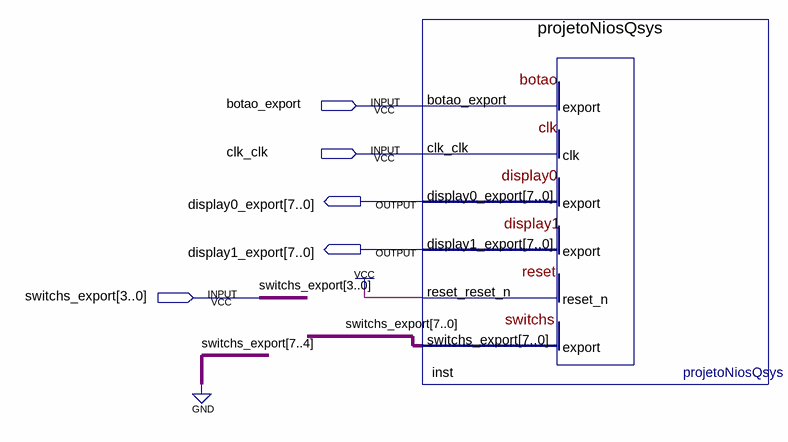
[diagram p0: schematic sheet]
// Quartus schematic ProjetoNios.bdf as structural Verilog: 1 symbols, 5 pins
module ProjetoNios (
  input  botao_export,
  input  clk_clk,
  input  [3:0] switchs_export,
  output [7:0] display0_export,
  output [7:0] display1_export
);

  projetoNiosQsys inst (
    .botao_export(botao_export), .clk_clk(clk_clk), .reset_reset_n(1'b1),
    .switchs_export({4'b0000, switchs_export}), .display0_export(display0_export),
    .display1_export(display1_export));
endmodule
